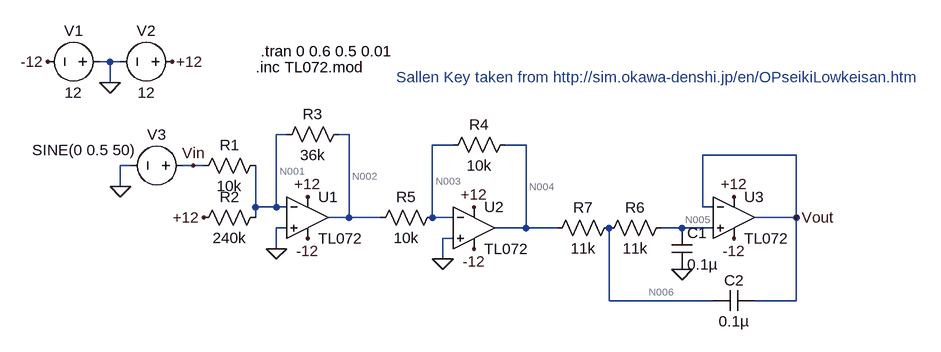
[diagram p0: schematic ELEC3400 Prac1 - Copy (2).asc]
ELEC3400 Prac1 - Copy (2).asc, the LTspice schematic file:
Version 4
SHEET 1 1648 680
WIRE -64 -80 -80 -80
WIRE -48 -80 -64 -80
WIRE -64 -48 -64 -80
WIRE 208 32 192 32
WIRE 304 32 288 32
WIRE 464 48 432 48
WIRE 576 48 544 48
WIRE 992 64 848 64
WIRE -32 80 -48 80
WIRE 64 80 48 80
WIRE 80 80 64 80
WIRE -48 112 -48 80
WIRE 160 144 160 80
WIRE 192 144 192 32
WIRE 192 144 160 144
WIRE 208 144 192 144
WIRE 848 144 848 64
WIRE 864 144 848 144
WIRE 160 160 160 144
WIRE 304 160 304 32
WIRE 304 160 272 160
WIRE 352 160 304 160
WIRE 432 160 432 48
WIRE 464 160 432 160
WIRE 992 160 992 64
WIRE 992 160 928 160
WIRE 208 176 192 176
WIRE 576 176 576 48
WIRE 576 176 528 176
WIRE 624 176 576 176
WIRE 816 176 784 176
WIRE 864 176 816 176
WIRE 464 192 448 192
WIRE 192 208 192 176
WIRE 448 224 448 192
WIRE 704 288 704 176
WIRE 864 288 704 288
WIRE 992 288 992 160
WIRE 992 288 928 288
FLAG -64 -48 0
FLAG 32 -80 +12
FLAG -160 -80 -12
FLAG 240 192 -12
FLAG 240 128 +12
FLAG 192 208 0
FLAG 80 160 +12
FLAG -48 112 0
FLAG 64 80 Vin
FLAG 496 208 -12
FLAG 496 144 +12
FLAG 448 224 0
FLAG 896 192 -12
FLAG 896 128 +12
FLAG 816 240 0
FLAG 992 160 Vout
SYMBOL Opamps\\opamp2 240 96 R0
SYMATTR InstName U1
SYMATTR Value TL072
SYMBOL voltage -64 -80 R90
WINDOW 0 -32 56 VBottom 2
WINDOW 3 32 56 VTop 2
WINDOW 123 0 0 Left 0
WINDOW 39 0 0 Left 0
SYMATTR InstName V1
SYMATTR Value 12
SYMBOL voltage 48 -80 R90
WINDOW 0 -32 56 VBottom 2
WINDOW 3 32 56 VTop 2
WINDOW 123 0 0 Left 0
WINDOW 39 0 0 Left 0
SYMATTR InstName V2
SYMATTR Value 12
SYMBOL res 176 64 R90
WINDOW 0 0 56 VBottom 2
WINDOW 3 32 56 VTop 2
SYMATTR InstName R1
SYMATTR Value 10k
SYMBOL res 176 144 R90
WINDOW 0 0 56 VBottom 2
WINDOW 3 32 56 VTop 2
SYMATTR InstName R2
SYMATTR Value 240k
SYMBOL res 304 16 R90
WINDOW 0 0 56 VBottom 2
WINDOW 3 32 56 VTop 2
SYMATTR InstName R3
SYMATTR Value 36k
SYMBOL voltage 64 80 R90
WINDOW 0 -32 56 VBottom 2
WINDOW 3 -40 168 VTop 2
WINDOW 123 0 0 Left 0
WINDOW 39 0 0 Left 0
SYMATTR InstName V3
SYMATTR Value SINE(0 0.5 50)
SYMBOL Opamps\\opamp2 496 112 R0
SYMATTR InstName U2
SYMATTR Value TL072
SYMBOL res 560 32 R90
WINDOW 0 0 56 VBottom 2
WINDOW 3 32 56 VTop 2
SYMATTR InstName R4
SYMATTR Value 10k
SYMBOL res 448 144 R90
WINDOW 0 0 56 VBottom 2
WINDOW 3 32 56 VTop 2
SYMATTR InstName R5
SYMATTR Value 10k
SYMBOL Opamps\\opamp2 896 96 R0
SYMATTR InstName U3
SYMATTR Value TL072
SYMBOL res 800 160 R90
WINDOW 0 0 56 VBottom 2
WINDOW 3 32 56 VTop 2
SYMATTR InstName R6
SYMATTR Value 11k
SYMBOL res 720 160 R90
WINDOW 0 0 56 VBottom 2
WINDOW 3 32 56 VTop 2
SYMATTR InstName R7
SYMATTR Value 11k
SYMBOL cap 800 176 R0
SYMATTR InstName C1
SYMATTR Value 0.1µ
SYMBOL cap 928 272 R90
WINDOW 0 0 32 VBottom 2
WINDOW 3 32 32 VTop 2
SYMATTR InstName C2
SYMATTR Value 0.1µ
TEXT 168 -96 Left 2 !.tran 0 0.6 0.5 0.01
TEXT 160 -72 Left 2 !.inc TL072.mod
TEXT 376 -56 Left 2 ;Sallen Key taken from http://sim.okawa-denshi.jp/en/OPseikiLowkeisan.htm

The netlist it stands for:
* ELEC3400 Prac1 - Copy (2).asc
XU1 0 N001 +12 -12 N002 TL072  ; pins In+ In- V+ V- OUT
V1 0 -12 12
V2 +12 0 12
R1 N001 Vin 10k
R2 N001 +12 240k
R3 N002 N001 36k
V3 Vin 0 SINE(0 0.5 50)
XU2 0 N003 +12 -12 N004 TL072  ; pins In+ In- V+ V- OUT
R4 N004 N003 10k
R5 N003 N002 10k
XU3 N005 Vout +12 -12 Vout TL072  ; pins In+ In- V+ V- OUT
R6 N005 N006 11k
R7 N006 N004 11k
C1 N005 0 0.1µ
C2 Vout N006 0.1µ
.tran 0 0.6 0.5 0.01
.inc TL072.mod
* Sallen Key taken from http://sim.okawa-denshi.jp/en/OPseikiLowkeisan.htm
.backanno
.end

* Results of the author's LTspice run, read from the files saved beside the schematic
* Operating Point, zero values left out:
*   V(n002) = -1.8 V
*   V(-12) = -12 V
*   V(+12) = 12 V
*   V(n001) = 19.12 µV
*   V(n004) = 1.8 V
*   V(n003) = 2.889 µV
*   V(vout) = 1.8 V
*   V(n005) = 1.8 V
*   V(n006) = 1.8 V
*   I(R7) = -43.86 pA
*   I(R6) = -43.86 pA
*   I(R5) = 180 µA
*   I(R4) = 180 µA
*   I(R3) = -50 µA
*   I(R2) = -50 µA
*   I(R1) = 1.912 nA
*   I(V3) = 1.912 nA
*   I(V2) = -34.23 mA
*   I(V1) = -34.18 mA
*   Ix(u1:1) = 42.05 pA
*   Ix(u1:2) = 42.05 pA
*   Ix(u1:3) = 11.39 mA
*   Ix(u1:4) = -11.39 mA
*   Ix(u1:5) = 230 µA
*   Ix(u2:1) = 42.05 pA
*   Ix(u2:2) = 42.05 pA
*   Ix(u2:3) = 11.39 mA
*   Ix(u2:4) = -11.39 mA
*   Ix(u2:5) = -180 µA
*   Ix(u3:1) = 43.86 pA
*   Ix(u3:2) = 43.86 pA
*   Ix(u3:3) = 11.39 mA
*   Ix(u3:4) = -11.39 mA
*   Ix(u3:5) = -43.86 pA
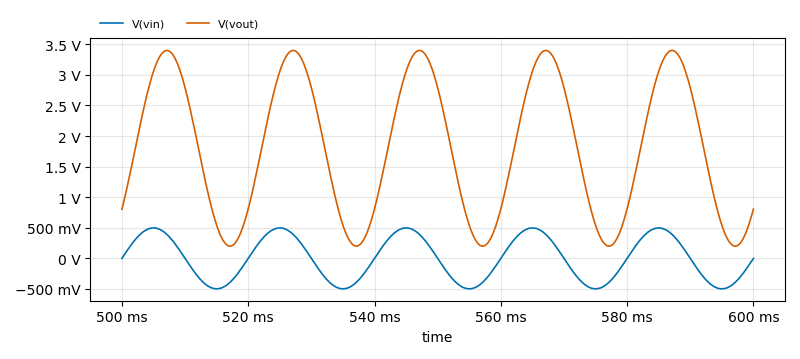
[diagram p1: Transient Analysis of ELEC3400 Prac1 - Copy (2).asc, plotted from the saved traces]
* Transient Analysis, 1 run:
*   V(vin): min -497.3 mV, max 497.3 mV, average 390.1 nV, rms 352.2 mV, last 0 V
*   V(vout): min 199 mV, max 3.401 V, average 1.8 V, rms 2.126 V, last 806.3 mV